# Altium project fp_tool.PrjPcb
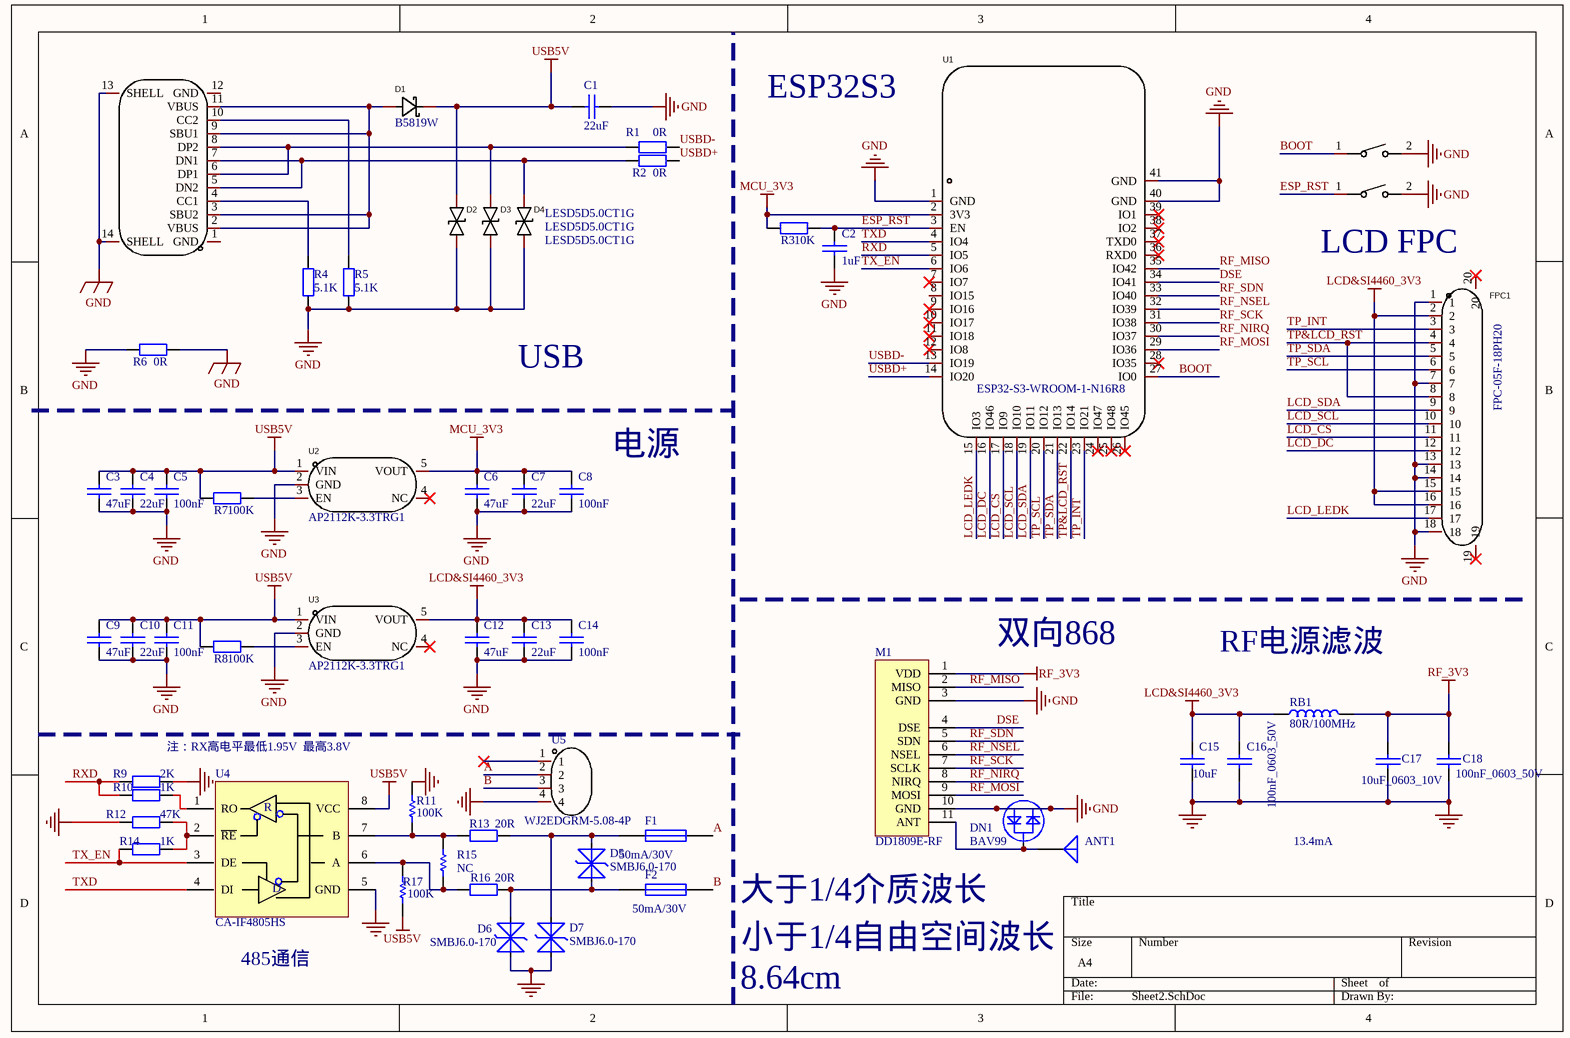
[diagram p0: Sheet2.SchDoc]
1 sheet, 57 parts. Net scope: global (net labels, ports and power ports of the same name join across sheets).
Board file: PCB1.PcbDoc

## Sheet Sheet2.SchDoc
size A4; SheetNumber: 2; SheetTotal: 2

### Parts
ANT1  (no value)  [18AWG]
C1  22uF  [0603_C]
C2  1uF  [0603_C]
C3  47uF  [0603_C]
C4  22uF  [0603_C]
C5  100nF  [0603_C]
C6  47uF  [0603_C]
C7  22uF  [0603_C]
C8  100nF  [0603_C]
C9  47uF  [0603_C]
C10  22uF  [0603_C]
C11  100nF  [0603_C]
C12  47uF  [0603_C]
C13  22uF  [0603_C]
C14  100nF  [0603_C]
C15  value 10uF  [0603_C]  (hidden comment: 10uF_0603_10V)
C16  100nF_0603_50V  [0603_C]
C17  10uF_0603_10V  [0603_C]
C18  100nF_0603_50V  [0603_C]
D1  B5819W  [SOD-123F_L2.7-W1.6-LS3.8-RD-1]
D2  LESD5D5.0CT1G  [SOD-523_L1.2-W0.8-LS1.6-BI]
D3  LESD5D5.0CT1G  [SOD-523_L1.2-W0.8-LS1.6-BI]
D4  LESD5D5.0CT1G  [SOD-523_L1.2-W0.8-LS1.6-BI]
D5  SMBJ6.0-170  [SMB(DO-214AA) - TVS]
D6  SMBJ6.0-170  [SMB(DO-214AA) - TVS]
D7  SMBJ6.0-170  [SMB(DO-214AA) - TVS]
DN1  BAV99  [SOT-23(SOT-23-3)]
F1  贴片自恢复保险丝 1812 0.1A 60V  [1206_R]  (value not drawn)
F2  贴片自恢复保险丝 1812 0.1A 60V  [1206_R]  (value not drawn)
FPC1  FPC-05F-18PH20  [FPC-SMD_18P-P0.50_FPC-05F-18PH20]
M1  DD1809E-RF  [DD1809(E)-RF-平]
R1  0R  [0603_R]
R2  0R  [0603_R]
R3  value 10K  [0603_R]  (hidden comment: 0R)
R4  5.1K  [0603_R]
R5  5.1K  [0603_R]
R6  0R  [0603_R]
R7  100K  [0603_R]
R8  100K  [0603_R]
R9  2K  [0603_R]
R10  1K  [0603_R]
R11  100K  [0603_R]
R12  47K  [0603_R]
R13  20R  [0603_R]
R14  1K  [0603_R]
R15  NC  [0603_R]
R16  20R  [0603_R]
R17  100K  [0603_R]
RB1  value 80R/100MHz  [0603_R]  (hidden comment: 80R/100MHz_0603)
SW1  TS-1088-AR02016  [SW-SMD_L3.9-W3.0-P4.45]  (value not drawn)
SW2  TS-1088-AR02016  [SW-SMD_L3.9-W3.0-P4.45]  (value not drawn)
U1  ESP32-S3-WROOM-1-N16R8  [WIRELM-SMD_ESP32-S3-WROOM-1]
U2  AP2112K-3.3TRG1  [SOT-25-5_L2.9-W1.6-P0.95-LS2.8-BL]
U3  AP2112K-3.3TRG1  [SOT-25-5_L2.9-W1.6-P0.95-LS2.8-BL]
U4  CA-IF4805HS  [SOP8]
U5  WJ2EDGRM-5.08-4P  [CONN-TH_4P-P5.08_WJ2EDGRM-5.08-4P-14-00A]
USB1  TYPE-C 16PIN 2MD(073)  [USB-C-SMD_TYPE-C-6PIN-2MD-073]  (value not drawn)

### Nets
GND: C1.2 C2.1 C3.1 C4.1 C5.1 C6.1 C7.1 C8.1 C9.1 C10.1 C11.1 C12.1 C13.1 C14.1 C15.2 C16.1 C17.1 C18.1 D2.1 D3.1 D4.1 D6.1 D7.1 DN1.1 DN1.2 FPC1.1 FPC1.7 FPC1.13 FPC1.14 FPC1.18 M1.3(GND) M1.10(GND) R4.1 R5.1 R6.1 R6.2 R9.1 R11.2 R12.1 SW1.2 SW2.2 U1.1(GND) U1.40(GND) U1.41(GND) U2.2(GND) U3.2(GND) U4.5(GND) U5.4 USB1.13(SHELL) USB1.14(SHELL)
LCD&SI4460_3V3: C12.2 C13.2 C14.2 C15.1 C16.2 FPC1.2 FPC1.15 FPC1.16 RB1.1 U3.5(VOUT)
MCU_3V3: C6.2 C7.2 C8.2 R3.1 U1.2(3V3) U2.5(VOUT)
RF_3V3: C17.2 C18.2 M1.1(VDD) RB1.2
USB5V: C1.1 C3.2 C4.2 C5.2 C9.2 C10.2 C11.2 D1.1(K) D2.2 R7.1 R8.1 R17.1 U2.1(VIN) U3.1(VIN) U4.8(VCC)
A: F1.2 U5.2
B: F2.2 U5.3
BOOT: SW1.1 U1.27(IO0)
DSE: M1.4(DSE) U1.34(IO41)
ESP_RST: C2.2 R3.2 SW2.1 U1.3(EN)
LCD_CS: FPC1.11 U1.17(IO9)
LCD_DC: FPC1.12 U1.16(IO46)
LCD_LEDK: FPC1.17 U1.15(IO3)
LCD_SCL: FPC1.10 U1.18(IO10)
LCD_SDA: FPC1.9 U1.19(IO11)
RF_MISO: M1.2(MISO) U1.35(IO42)
RF_MOSI: M1.9(MOSI) U1.29(IO36)
RF_NIRQ: M1.8(NIRQ) U1.30(IO37)
RF_NSEL: M1.6(NSEL) U1.32(IO39)
RF_SCK: M1.7(SCLK) U1.31(IO38)
RF_SDN: M1.5(SDN) U1.33(IO40)
RXD: R9.2 R10.1 U1.5(IO5)
TP&LCD_RST: FPC1.4 FPC1.8 U1.22(IO14)
TP_INT: FPC1.3 U1.23(IO21)
TP_SCL: FPC1.6 U1.20(IO12)
TP_SDA: FPC1.5 U1.21(IO13)
TX_EN: R14.1 U1.6(IO6) U4.3(DE)
TXD: U1.4(IO4) U4.4(DI)
USBD+: R2.2 U1.14(IO20)
USBD-: R1.2 U1.13(IO19)
NetANT1_1: ANT1.1(A) DN1.3 M1.11(ANT)
NetD1_2: D1.2(A) USB1.2(VBUS) USB1.3(SBU2) USB1.9(SBU1) USB1.11(VBUS)
NetD3_2: D3.2 R1.1 USB1.6(DP1) USB1.8(DP2)
NetD4_2: D4.2 R2.1 USB1.5(DN2) USB1.7(DN1)
NetD5_1: D5.1 D6.2 F2.1 R16.1
NetD5_2: D5.2 D7.2 F1.1 R13.1
NetR4_2: R4.2 USB1.4(CC1)
NetR5_2: R5.2 USB1.10(CC2)
NetR7_2: R7.2 U2.3(EN)
NetR8_2: R8.2 U3.3(EN)
NetR10_2: R10.2 U4.1(RO)
NetR11_1: R11.1 R13.2 R15.2 U4.7(B)
NetR12_2: R12.2 R14.2 U4.2(~{RE})
NetR15_1: R15.1 R16.2 R17.2 U4.6(A)

Not connected (* = marked no-connect by the designer): FPC1 19* 20*; U1 7(IO7)* 8(IO15) 9(IO16)* 10(IO17)* 11(IO18)* 12(IO8)* 24(IO47)* 25(IO48)* 26(IO45)* 28(IO35)* 36(RXD0)* 37(TXD0)* 38(IO2)* 39(IO1)*; U2 4(NC)*; U3 4(NC)*; U5 1*; USB1 1(GND) 12(GND)

### Notes on the sheet
- ESP32S3
- LCD FPC
- USB
- (near C8) 电源
- 双向868
- RF电源滤波
- 注：RX高电平最低1.95V  最高3.8V
- 13.4mA
- 大于1/4介质波长
- 485通信
- 小于1/4自由空间波长
- 8.64cm
- (in symbol Fuse 1) 50mA/30V
- (in symbol MAX485E) R; D

### Library data of the parts
ANT1 = Antenna: Generic Antenna; Published: 24-Mar-1999; LatestRevisionDate: 17-Jul-2002; LatestRevisionNote: Re-released for DXP Platform.; PackageReference: PIN1; Publisher: Altium Limited
C1-C14 = CAP_SMT: 贴片电容
C15 = 10uF_0603_10V: 瓷片电容 X5R-0603-10V-10uF/C-±10%; 封装: 0603; 品号: 3100034033; 补充说明: *; 品名: 瓷片电容	X5R-0603-10V-10uF/C-±10%
C16 C18 = 100nF_0603_50V: 电容 瓷片 X7R-0603-50V-0.1uF/C-±10%; VALUE: 100nF; 封装: 0603; 品号: 3100022700; 补充说明: *; 品名: 电容 瓷片 X7R-0603-50V-0.1uF/C-±10%
C17 = 10uF_0603_10V: 瓷片电容 X5R-0603-10V-10uF/C-±10%; VALUE: 10uF; 封装: 0603; 品号: 3100034033; 补充说明: *; 品名: 瓷片电容	X5R-0603-10V-10uF/C-±10%
D1 = B5819W: Manufacturer: GOODWORK(固得沃克); Symbol: B5819W_C2943878; Add into BOM: yes; Reverse Voltage (Vr): 40V; Average Rectified Current (Io): 1A; Forward Voltage (Vf@If): 580mV@1A; Reverse Leakage Current (Ir): 50uA@40V; Name: B5819W; Device: B5819W; LCSC Part Name: 40V 1A 580mV@1A; Supplier Part: C2943878; Manufacturer Part: B5819W; Supplier Footprint: SOD-123; JLCPCB Part Class: Extended Part; Datasheet: https://atta.szlcsc.com/upload/public/pdf/source/20220114/81042131F39C8520B6390246D7392C1A.pdf; Supplier: LCSC; Convert to PCB: yes; Diode Configuration: -
D2-D4 = LESD5D5.0CT1G: Manufacturer: LRC(乐山无线电); Add into BOM: yes; Polarity: 双向; Reverse Stand-Off Voltage (Vrwm): 5V; Breakdown Voltage (VBR): 5.6V; Peak Pulse Current(Ipp)@8/20us: 9.4A; Clamping Voltage@Ipp: 18.6V; Name: LESD5D5.0CT1G; Symbol: LESD5D5.0CT1G; Device: LESD5D5.0CT1G; LCSC Part Name: 双向ESD; Supplier Part: C383211; Manufacturer Part: LESD5D5.0CT1G; Supplier Footprint: SOD-523; JLCPCB Part Class: Extended Part; Datasheet: https://atta.szlcsc.com/upload/public/pdf/source/20190807/C383211_633DF4B4E2C161403226E5235FE33A1C.pdf; Supplier: LCSC; Convert to PCB: yes
D5-D7 = TVS
DN1 = BAV99: 品号: 3101002543; 品名: 开关二极管 BAV99 SOT-23; 规格: SMD【贴片】
F1 F2 = Fuse 1: Fuse; Published: 8-Jun-2000; LatestRevisionDate: 17-Jul-2002; LatestRevisionNote: Re-released for DXP Platform.; PackageReference: PIN-W2/E2.8; Publisher: Altium Limited
FPC1 = FPC-05F-18PH20: Manufacturer: XUNPU(讯普); Add into BOM: yes; Pitch: 0.5mm; Number of Contacts: 18P; Locking Feature: 翻盖式; FFC, FCB Thickness: 0.3mm; Name: FPC-05F-18PH20; Symbol: FPC-05F-18PH20; Device: FPC-05F-18PH20; LCSC Part Name: 0.5mm P数:18P 翻盖式 下接; Supplier Part: C2856802; Manufacturer Part: FPC-05F-18PH20; Supplier Footprint: SMD,P=0.5mm; JLCPCB Part Class: Extended Part; Datasheet: https://atta.szlcsc.com/upload/public/pdf/source/20210922/C2856802_2A845D1961F33AEC1ED22CECB292335F.pdf; Supplier: LCSC; Convert to PCB: yes; Mounting Type: 卧贴; Contact Type: 下接; Height Above Board: 2mm; Operating Temperature Range: -25℃~+85℃
M1 = DD1809E-RF: 平插
R1-R8 = RES: Resistor; Published: 8-Jun-2000; LatestRevisionDate: 17-Jul-2002; LatestRevisionNote: Re-released for DXP Platform.; Publisher: Altium Limited
  R1 R2 R6: Value: 0R
  R4 R5: Value: 5.1K
  R7 R8: Value: 100K
R9 R10 R12 R14 = Res2: Resistor; Published: 8-Jun-2000; LatestRevisionDate: 17-Jul-2002; LatestRevisionNote: Re-released for DXP Platform.; Publisher: Altium Limited
  R9: Value: 2K
  R10 R14: Value: 1K
  R12: Value: 47K
R11 R17 = Res1: Resistor; Value: 10K; Published: 8-Jun-2000; LatestRevisionDate: 17-Jul-2002; LatestRevisionNote: Re-released for DXP Platform.; PackageReference: AXIAL-0.3; Publisher: Altium Limited
R13 R16 = Res2: Resistor; Value: 10K; Published: 8-Jun-2000; LatestRevisionDate: 17-Jul-2002; LatestRevisionNote: Re-released for DXP Platform.; PackageReference: AXIAL-0.3; Publisher: Altium Limited
R15 = Res1: Resistor; Published: 8-Jun-2000; LatestRevisionDate: 17-Jul-2002; LatestRevisionNote: Re-released for DXP Platform.; PackageReference: AXIAL-0.3; Publisher: Altium Limited; Value: NC
RB1 = 80R/100MHz_0603: 磁珠 80R/100MHZ 贴片0603; 品号: 3101000899; 封装: R0603; 补充说明: *; 品名: 磁珠 80R/100MHZ 贴片0603
SW1 SW2 = KEY: Manufacturer: XUNPU(讯普); Add into BOM: yes; Contact Current: 50mA; Voltage Rating (DC): 12V; Insulation Resistance: 100MΩ; Circuit: 单刀单掷; Actuator Style: 圆形按钮; Actuator/Cap Color: 黑色; Operating Force: 160gf@±50gf; Mechanical Life: 10万次; Pin Style: SMD接片; Switch Length: 4mm; Switch Width: 3mm; Switch Height: 2mm; Strike Gundam: 否; Name: TS-1088-AR02016; Symbol: TS-1088-AR02016; Device: TS-1088-AR02016; LCSC Part Name: 4*3*2mm 立贴 轻触开关; Supplier Part: C720477; Manufacturer Part: TS-1088-AR02016; Supplier Footprint: SMD; JLCPCB Part Class: Extended Part; Datasheet: https://atta.szlcsc.com/upload/public/pdf/source/20200810/C720475_60D09DD6C54279ADDB2DC25100F1CC11.pdf; Supplier: LCSC; Convert to PCB: yes; Mounting Style: 立贴; Operating Temperature: -30℃~+80℃
U1 = ESP32-S3-WROOM-1-N16R8: Manufacturer: ESPRESSIF(乐鑫); Symbol: ESP32-S3-WROOM-1(N16R8); Add into BOM: yes; Name: ESP32-S3-WROOM-1-N16R8; Device: ESP32-S3-WROOM-1-N16R8; LCSC Part Name: 通用型Wi-Fi+低功耗蓝牙MCU模组; Supplier Part: C2913202; Manufacturer Part: ESP32-S3-WROOM-1-N16R8; Supplier Footprint: SMD,18x25.5mm; JLCPCB Part Class: Extended Part; Datasheet: https://atta.szlcsc.com/upload/public/pdf/source/20220705/4E799F39581577F766659887F738A439.pdf; Supplier: LCSC; Convert to PCB: yes
U2 U3 = AP2112K-3.3TRG1: Manufacturer: DIODES(美台); Add into BOM: yes; Output Type: 固定; Output Polarity: 正; Number of Outputs: 1; Maximum Input Voltage: 6V; Output Voltage: 3.3V; Dropout Voltage: 400mV@(600mA); Output Current: 600mA; Power Supply Rejection Ratio (PSRR): 65dB@(100Hz,1kHz); Name: AP2112K-3.3TRG1; Symbol: AP2112K-3.3TRG1; Device: AP2112K-3.3TRG1; LCSC Part Name: AP2112K-3.3TRG1; Supplier Part: C51118; Manufacturer Part: AP2112K-3.3TRG1; Supplier Footprint: SOT-25-5; JLCPCB Part Class: Extended Part; Datasheet: https://atta.szlcsc.com/upload/public/pdf/source/20171221/C51118_15138312998391195590.pdf; Supplier: LCSC; Convert to PCB: yes
U4 = MAX485E
U5 = WJ2EDGRM-5.08-4P: 连接器类型:板端/插座-闭口;间距:5.08mm;排数:1;每排PIN数:4;安装方式:弯针;颜色:绿色;固定方式:螺丝固定;; Manufacturer: KANGNEX(康奈克斯电气); Symbol: WJ2EDGRM-5.08-4P-14-00A; Add into BOM: yes; Pitch: 5.08mm; Number of PINs Per Row: 4; fixed form: 螺丝固定; Device: WJ2EDGRM-5.08-4P; LCSC Part Name: 板端/插座-闭口 5.08mm 排数:1 每排P数:4 弯针 螺丝固定; Supplier Part: C122715; Manufacturer Part: WJ2EDGRM-5.08-4P; Supplier Footprint: P=5.08mm; JLCPCB Part Class: 扩展库; Datasheet: https://atta.szlcsc.com/upload/public/pdf/source/20191225/C122715_5EDD850D23D79873C9DD0610CAA761C1.pdf; Supplier: LCSC; Convert to PCB: yes; Connector Type: 板端/插座-闭口; Number of Rows: 1; Mounting Style: 弯针; Color: 绿色; Name: WJ2EDGRM-5.08-4P
USB1 = TYPE-C 16PIN 2MD(073): Manufacturer: SHOU HAN(首韩); Add into BOM: yes; Gender: 母座; Number of Contacts: 16; Number of Ports: 1; Current Rating - Power (Max): 5A; Name: TYPE-C 16PIN 2MD(073); Symbol: TYPE-C 16PIN 2MD(073); Device: TYPE-C 16PIN 2MD(073); LCSC Part Name: TYPE-C母座 16P 4脚插件带定位柱 不锈钢外壳 2次模顶; Supplier Part: C2765186; Manufacturer Part: TYPE-C 16PIN 2MD(073); Supplier Footprint: SMD; JLCPCB Part Class: Extended Part; Supplier: LCSC; Convert to PCB: yes; Connector Type: Type-C; Standard: -; Mounting Style: 卧贴; Operating Temperature Range: -25℃~+85℃